# Altium schematic sheet KeyPad.SchDoc: Key Pad
size 420 x 297 mm; Date: UNUSED; Author: RT; CompanyName: CMT; DrawnBy: UNUSED; Engineer: UNUSED; Organization: Curtin Motorsport Team; Address1: Rm 151 Building 206; Address2: Curtin University; Address3: Kent Street, Bently; Address4: Western Australia; DocumentNumber: UNUSED; Revision: UNUSED; SheetNumber: 4; SheetTotal: 5; Year: UNUSED; SheetSize: A3; Time: UNUSED; ImagePath: UNUSED; Application_BuildNumber: UNUSED
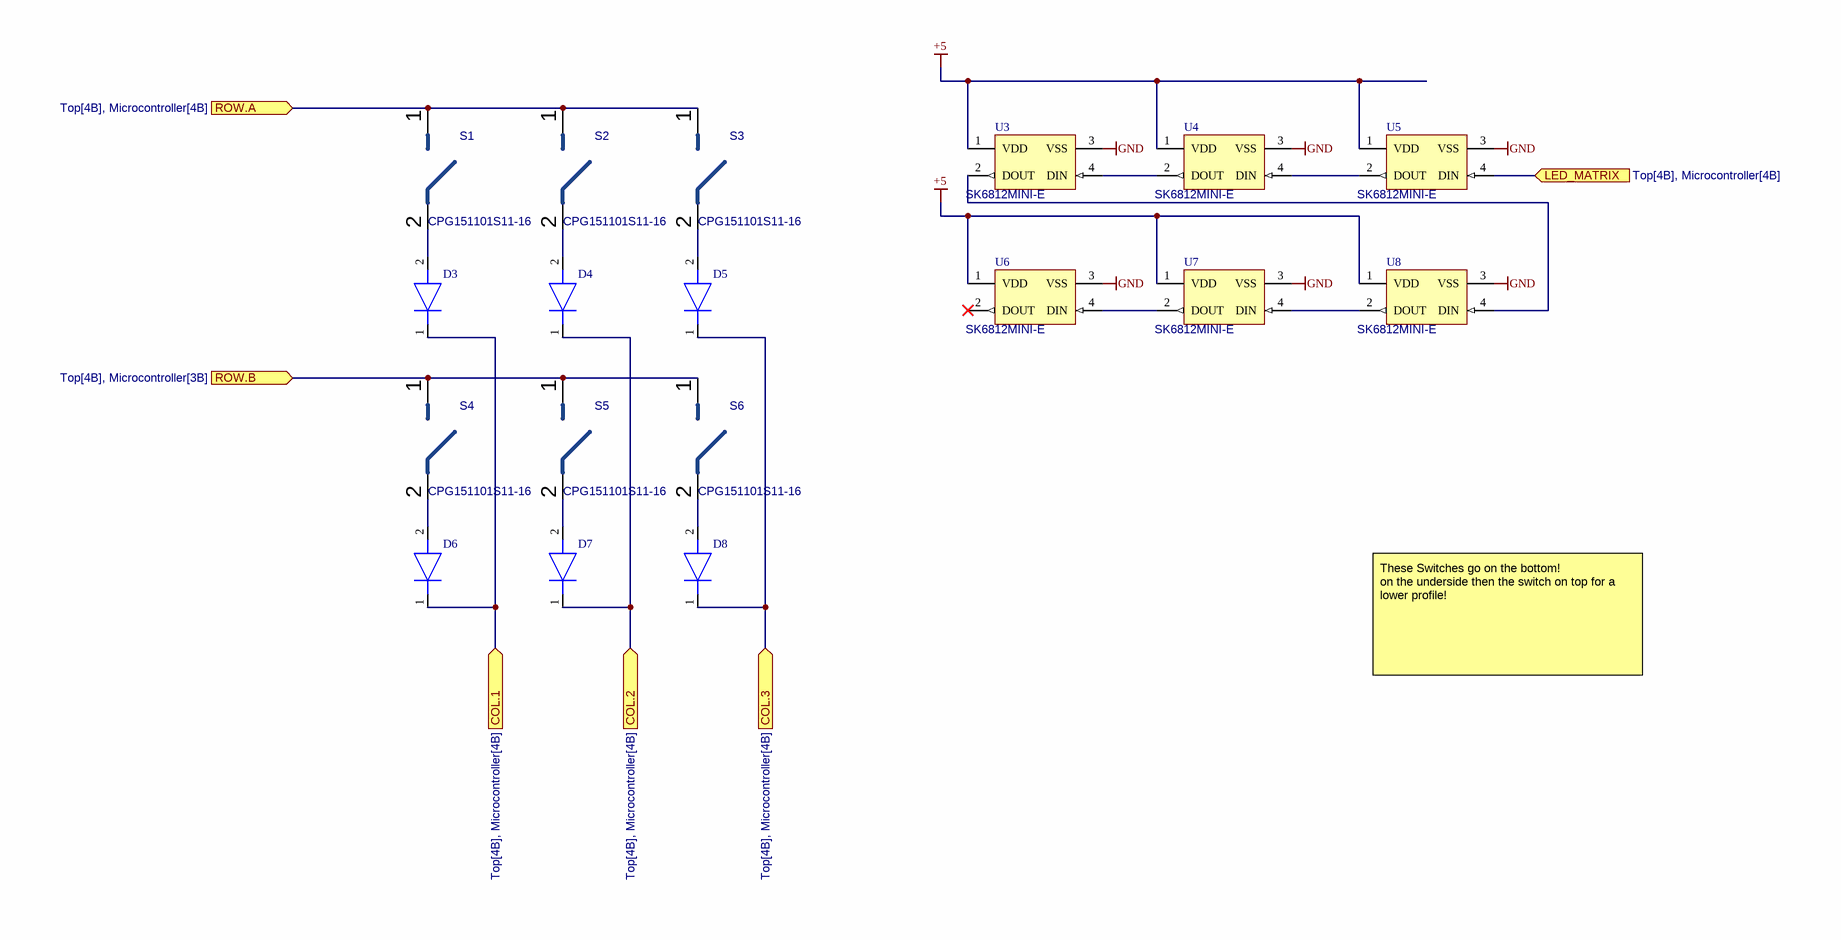
[diagram p0: KeyPad.SchDoc]

## Parts
D3  NSVR1020MW2T1G  [SOD2512X110N]  (value not drawn)
D4  NSVR1020MW2T1G  [SOD2512X110N]  (value not drawn)
D5  NSVR1020MW2T1G  [SOD2512X110N]  (value not drawn)
D6  NSVR1020MW2T1G  [SOD2512X110N]  (value not drawn)
D7  NSVR1020MW2T1G  [SOD2512X110N]  (value not drawn)
D8  NSVR1020MW2T1G  [SOD2512X110N]  (value not drawn)
S1  CPG151101S11-16  [CPG151101S11-16-Footprint-1]
S2  CPG151101S11-16  [CPG151101S11-16-Footprint-1]
S3  CPG151101S11-16  [CPG151101S11-16-Footprint-1]
S4  CPG151101S11-16  [CPG151101S11-16-Footprint-1]
S5  CPG151101S11-16  [CPG151101S11-16-Footprint-1]
S6  CPG151101S11-16  [CPG151101S11-16-Footprint-1]
U3  SK6812MINI-E  [Copy of ADAI-WS2812B_V]
U4  SK6812MINI-E  [Copy of ADAI-WS2812B_V]
U5  SK6812MINI-E  [Copy of ADAI-WS2812B_V]
U6  SK6812MINI-E  [Copy of ADAI-WS2812B_V]
U7  SK6812MINI-E  [Copy of ADAI-WS2812B_V]
U8  SK6812MINI-E  [Copy of ADAI-WS2812B_V]

## Ports
COL.1 (in, see Top[4B], Microcontroller[4B]), COL.2 (in, see Top[4B], Microcontroller[4B]), COL.3 (in, see Top[4B], Microcontroller[4B]), LED_MATRIX (in, see Top[4B], Microcontroller[4B]), ROW.A (in, see Top[4B], Microcontroller[4B]), ROW.B (in, see Top[4B], Microcontroller[3B])

## Nets
+5: U3.1(VDD) U4.1(VDD) U5.1(VDD) U6.1(VDD) U7.1(VDD) U8.1(VDD)
GND: U3.3(VSS) U4.3(VSS) U5.3(VSS) U6.3(VSS) U7.3(VSS) U8.3(VSS)
COL.1: D3.1(K) D6.1(K) ; port COL.1
COL.2: D4.1(K) D7.1(K) ; port COL.2
COL.3: D5.1(K) D8.1(K) ; port COL.3
LED_MATRIX: U5.4(DIN) ; port LED_MATRIX
ROW.A: S1.1 S2.1 S3.1 ; port ROW.A
ROW.B: S4.1 S5.1 S6.1 ; port ROW.B
NetD3_2: D3.2(A) S1.2
NetD4_2: D4.2(A) S2.2
NetD5_2: D5.2(A) S3.2
NetD6_2: D6.2(A) S4.2
NetD7_2: D7.2(A) S5.2
NetD8_2: D8.2(A) S6.2
NetU3_2: U3.2(DOUT) U8.4(DIN)
NetU3_4: U3.4(DIN) U4.2(DOUT)
NetU4_4: U4.4(DIN) U5.2(DOUT)
NetU6_4: U6.4(DIN) U7.2(DOUT)
NetU7_4: U7.4(DIN) U8.2(DOUT)

Not connected (* = marked no-connect by the designer): U6 2(DOUT)*

## Notes on the sheet
- These Switches go on the bottom!
  on the underside then the switch on top for a lower profile!
- Project:
- Title:
- Project Number:
- Size:
- Status:
- Revision:
- Year:
- Design Date:
- Author:
- Latest Revision Date:
- Sheet
- Checked:
- Checked
- of
- Date:

## Library data of the parts
D3-D8 = CMP-020-000003-1: Diode; Manufacturer_Name: onsemi; Design Item ID: NSVR1020MW2T1G; Datasheet Link: http://www.onsemi.com/pub/Collateral/NSR1020MW2T1-D.PDF; Arrow Price/Stock: https://www.arrow.com/en/products/nsvr1020mw2t1g/on-semiconductor; Height: 1.1mm; Mouser Part Number: 863-NSVR1020MW2T1G; Mouser Price/Stock: https://www.mouser.co.uk/ProductDetail/onsemi/NSVR1020MW2T1G?qs=tCMd4XlZ%2FiDUu7qH%252Bxas4w%3D%3D; Manufacturer_Part_Number: NSVR1020MW2T1G; Source: SamacSys.SchLib; Arrow Part Number: NSVR1020MW2T1G
S1-S6 = CMP-011-00039-6: Manufacturer_Name: Kalih; Current Rating: 10mA; Throw Configuration: SPST; Max Current Rating: 1A; Voltage Rating: 12V; Purchasing Link 3: https://www.amazon.com.au/Hot-swap-CPG151101S11-Mechanical-Keyboard-Accessories/dp/B0BVH6M5FP?th=1; Pins: 2; Max Operating Temperature: 60°C; Purchasing Link 2: https://www.gateron.com/products/gateron-hot-swap-pcb-socket?VariantsId=10170; Min Operating Temperature: -10°C; Purchasing Link: https://www.digikey.com.au/en/products/detail/adafruit-industries-llc/4958/13997772; Mounting Technology: SMT; RoHS Compliant: -; Manufacturer_Part_Number: CPG151101S11-16
U3-U8 = CMP-007-00047-8: Intelligent Control LED Integrated Light Source, 3.5 to 5.3 V, -25 to 80 degC, 4-Pin SMD, RoHS, Bulk; Manufacturer: Adafruit Industries; Manufacturer_Name: Dongguan Opsco; Forward Current: 10mA; Forward Voltage: 5.5V; Colour: RGB Addressable; Manufacturer URL: https://www.adafruit.com/; Datasheet Version: May-13; Max Operating Temperature: 85°C; Case/Package: 6028; Pins: 4; Mounting Technology: BOTTOM MOUNT SMT; RoHS Compliant: False; Package Description: 4-Pin Surface Mount Device, Body 5 x 5 mm, Pitch 3.3 mm; Package Reference: SK6812MINI-E; Manufacturer_Part_Number: SK6812MINI-E